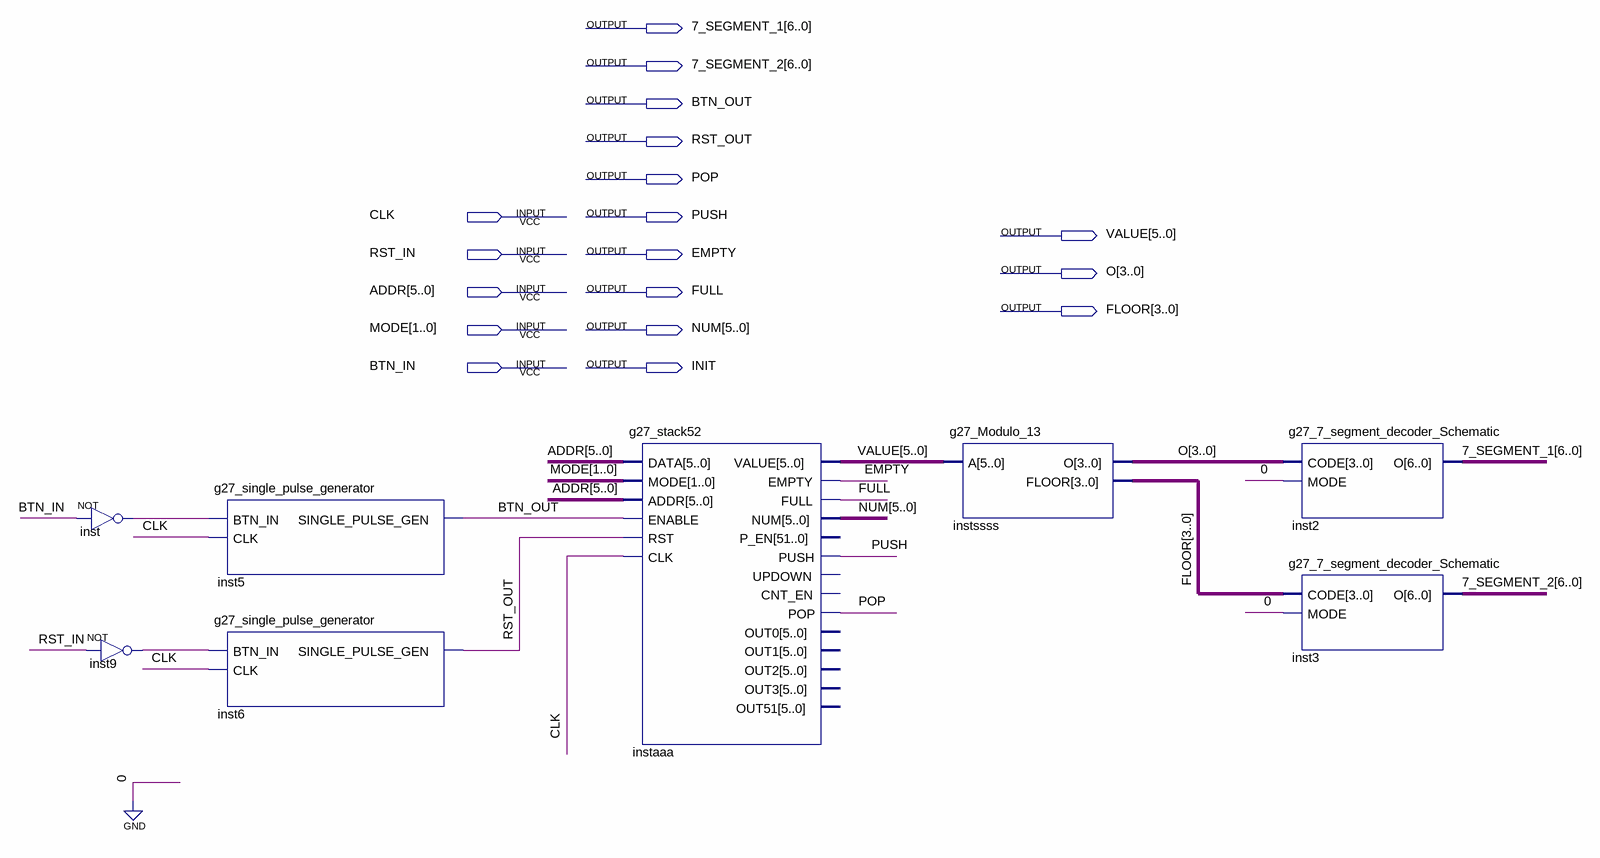
[diagram p0: schematic sheet]
// Quartus schematic g27_test_bed-DESKTOP-UCC89N9.bdf as structural Verilog: 8 symbols, 18 pins
module \g27_test_bed-DESKTOP-UCC89N9  (
  input  CLK,
  input  RST_IN,
  input  [5:0] ADDR,
  input  [1:0] MODE,
  input  BTN_IN,
  output [6:0] \7_SEGMENT_1 ,
  output [6:0] \7_SEGMENT_2 ,
  output BTN_OUT,
  output RST_OUT,
  output POP,
  output PUSH,
  output [5:0] VALUE,
  output EMPTY,
  output [3:0] O,
  output FULL,
  output [3:0] FLOOR,
  output [5:0] NUM,
  output INIT
);

  wire inst9_out, inst_out;

  not inst (inst_out, BTN_IN);
  not inst9 (inst9_out, RST_IN);
  g27_single_pulse_generator inst5 (.BTN_IN(inst_out), .CLK(CLK), .SINGLE_PULSE_GEN(BTN_OUT));
  g27_single_pulse_generator inst6 (.BTN_IN(inst9_out), .CLK(CLK), .SINGLE_PULSE_GEN(RST_OUT));
  g27_stack52 instaaa (
    .DATA(ADDR), .MODE(MODE), .ADDR(ADDR), .ENABLE(BTN_OUT), .RST(RST_OUT), .CLK(CLK), .VALUE(VALUE),
    .EMPTY(EMPTY), .FULL(FULL), .NUM(NUM), .PUSH(PUSH), .POP(POP));  // open: P_EN, UPDOWN, CNT_EN, OUT0, OUT1, OUT2, OUT3, OUT51
  g27_Modulo_13 instssss (.A(VALUE), .O(O), .FLOOR(FLOOR));
  g27_7_segment_decoder_Schematic inst2 (.CODE(O), .MODE(1'b0), .O(\7_SEGMENT_1 ));
  g27_7_segment_decoder_Schematic inst3 (.CODE(FLOOR), .MODE(1'b0), .O(\7_SEGMENT_2 ));
endmodule
